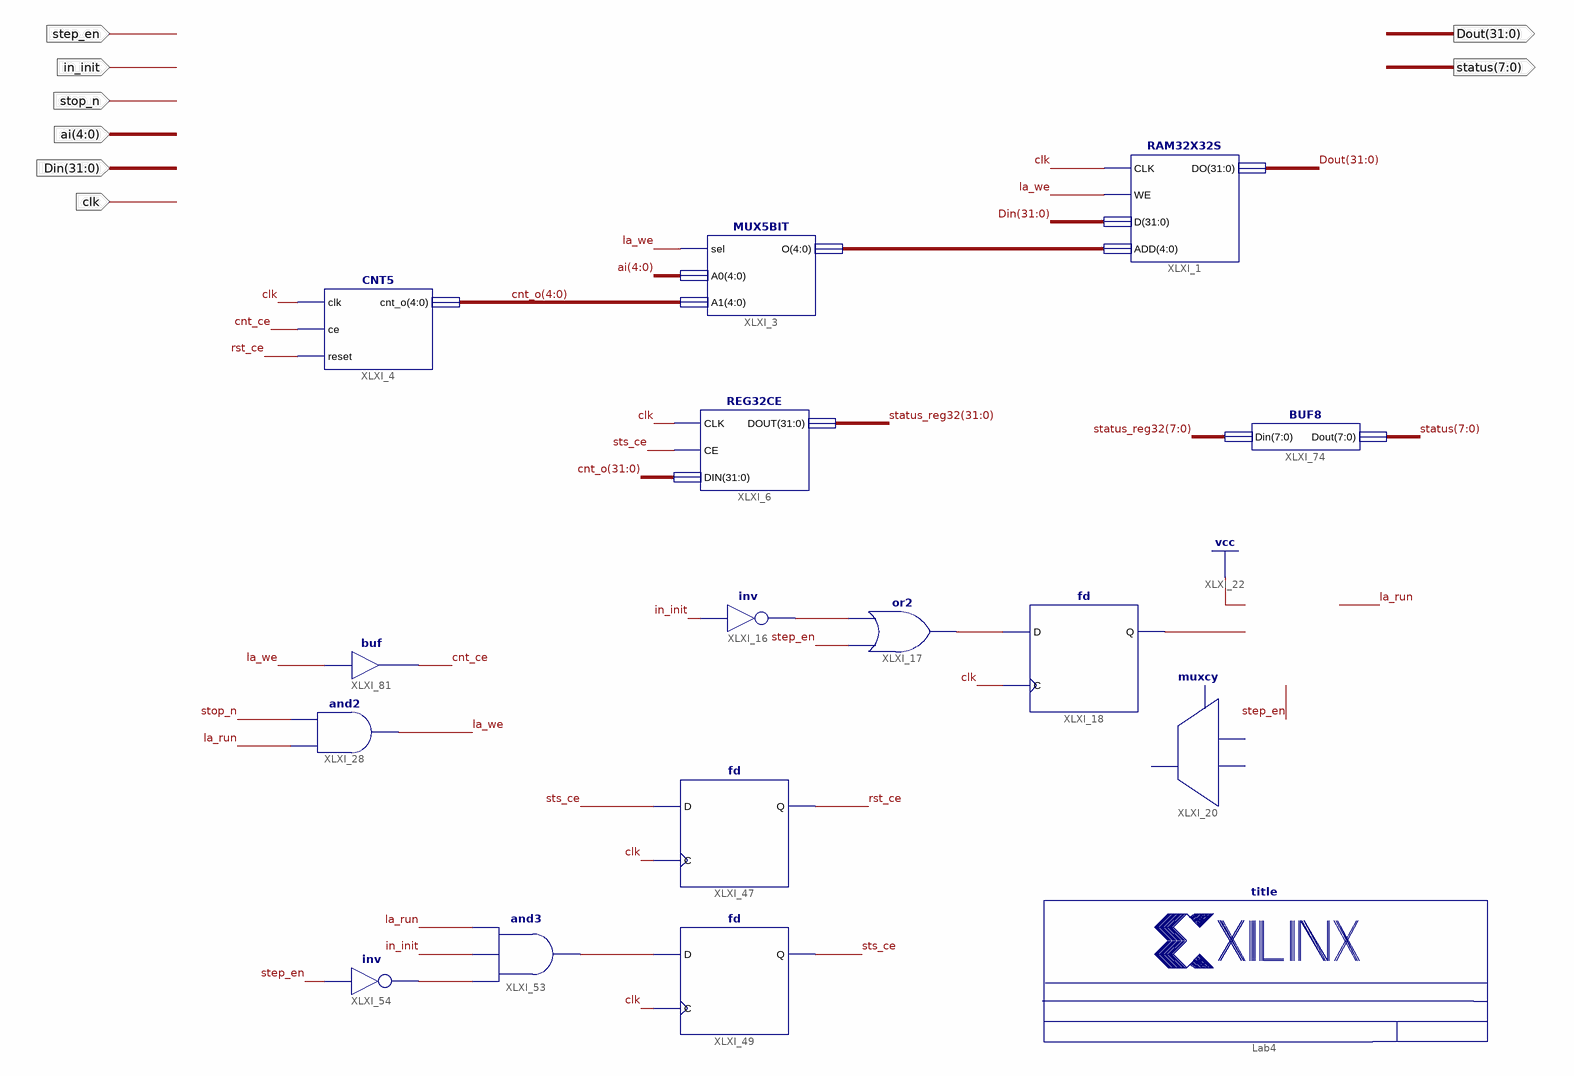
[diagram p0: schematic sheet 1]
// Xilinx ISE schematic logic_analyzer.sch (spartan6) as structural Verilog: 16 symbols, 8 ports
module logic_analyzer (
  input  in_init,
  input  [4:0] ai,
  input  clk,
  input  [31:0] Din,
  input  step_en,
  input  stop_n,
  output [31:0] Dout,
  output [7:0] status
);

  wire cnt_ce, la_run, la_we, rst_ce, sts_ce, XLXN_75, XLXN_78, XLXN_82, XLXN_124, XLXN_140;
  wire [4:0] XLXN_17;
  wire [31:0] cnt_o, status_reg32;

  MUX5BIT XLXI_3 (.sel(la_we), .A0(ai), .A1(cnt_o[4:0]), .O(XLXN_17));
  CNT5 XLXI_4 (.clk(clk), .ce(cnt_ce), .reset(rst_ce), .cnt_o(cnt_o[4:0]));
  REG32CE XLXI_6 (.CLK(clk), .CE(sts_ce), .DIN(cnt_o), .DOUT(status_reg32));
  RAM32X32S XLXI_1 (.CLK(clk), .WE(la_we), .D(Din), .ADD(XLXN_17), .DO(Dout));
  not XLXI_16 (XLXN_75, in_init);
  or XLXI_17 (XLXN_82, step_en, XLXN_75);
  fd XLXI_18 (.C(clk), .D(XLXN_82), .Q(XLXN_78));
  muxcy XLXI_20 (.CI(1'b1), .DI(XLXN_78), .S(step_en), .O(la_run));
  and XLXI_28 (la_we, la_run, stop_n);
  BUF8 XLXI_74 (.Din(status_reg32[7:0]), .Dout(status));
  buf XLXI_81 (cnt_ce, la_we);
  fd XLXI_47 (.C(clk), .D(sts_ce), .Q(rst_ce));
  fd XLXI_49 (.C(clk), .D(XLXN_124), .Q(sts_ce));
  and XLXI_53 (XLXN_124, XLXN_140, in_init, la_run);
  not XLXI_54 (XLXN_140, step_en);
  title #(.TitleFieldText("Lab 4 - Logic Analyzer"), .NameFieldText("Nizar Khalaila - 212683932, Reaal Abuhof - 208866145")) Lab4 ();
endmodule
